# Altium schematic sheet CMSIS-DAP-Pro.SchDoc
size A4
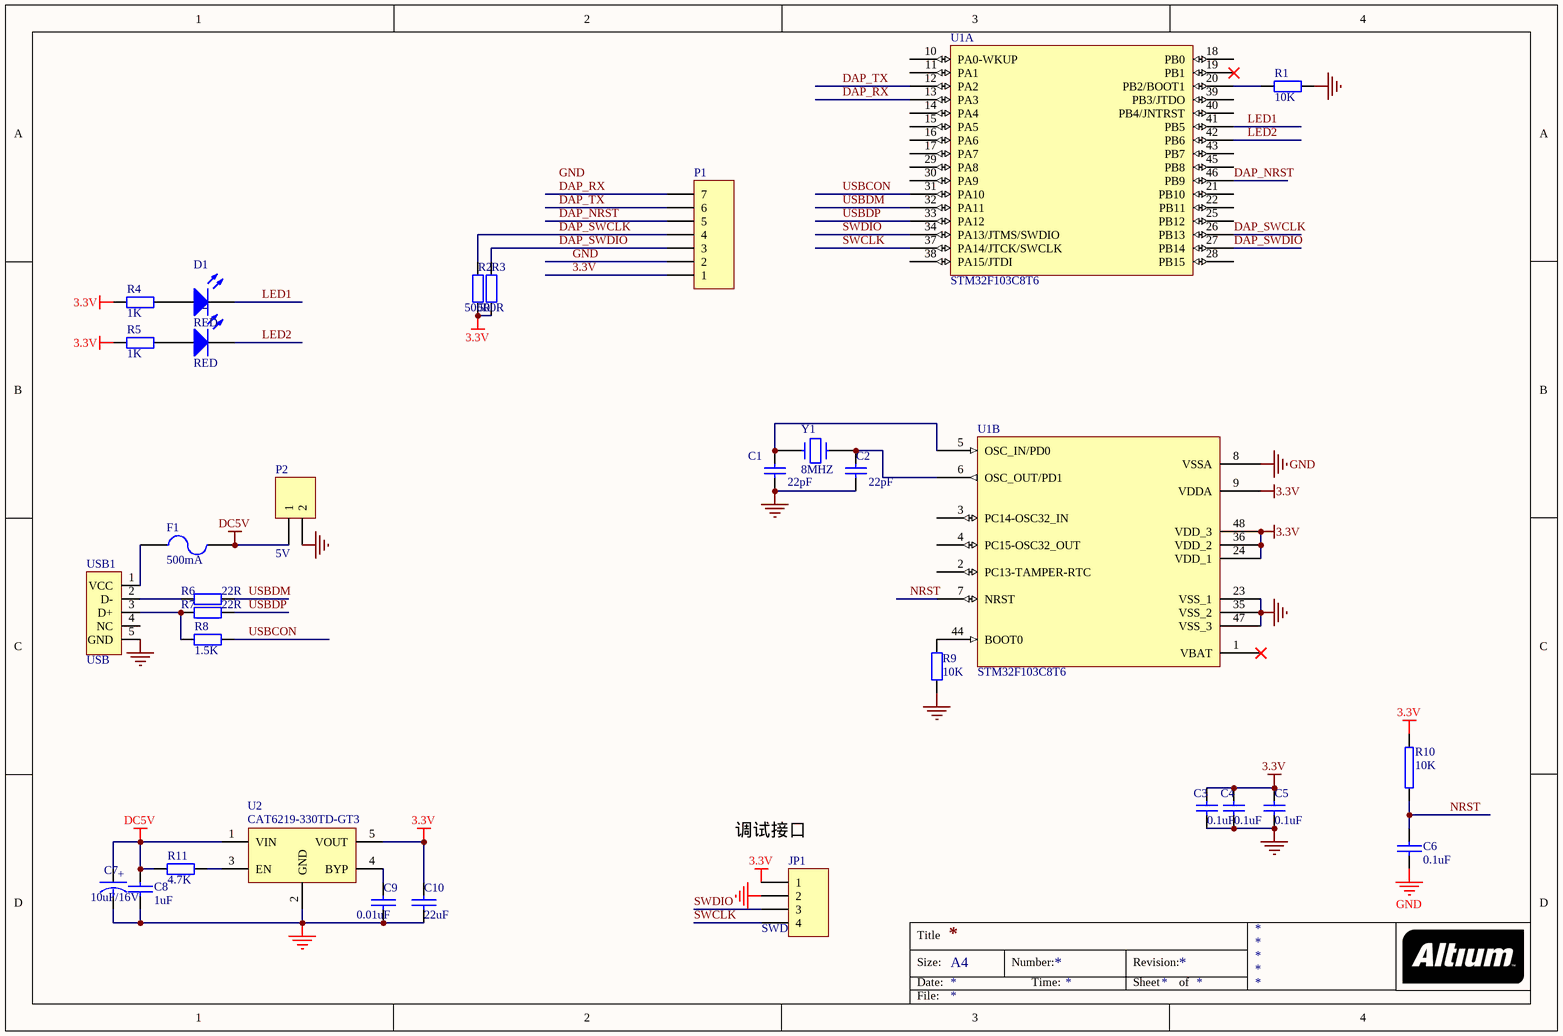
[diagram p0: CMSIS-DAP-Pro.SchDoc]

## Parts
C1  22pF  [0603C]
C2  22pF  [0603C]
C3  0.1uF  [0603C]
C4  0.1uF  [0603C]
C5  0.1uF  [0603C]
C6  0.1uF  [0603C]
C7  10uF/16V  [CAP-A]
C8  1uF  [0603C]
C9  0.01uF  [0603C]
C10  22uF  [0603C]
D1  RED  [LED-0805]
D2  RED  [LED-0805]
F1  500mA  [0805]
JP1  SWD  [PH2-4P]
P1  Header 7  [PH-7P-1.25mm]  (value not drawn)
P2  5V  [HDR1X2]
R1  10K  [0603R]
R2  500R  [0603R]
R3  500R  [0603R]
R4  1K  [0603R]
R5  1K  [0603R]
R6  22R  [0603R]
R7  22R  [0603R]
R8  value 1.5K  [0603R]  (hidden comment: Res1)
R9  10K  [0603R]
R10  10K  [0603R]
R11  4.7K  [0603R]
U1  STM32F103C8T6  [LQFP48_L]  (parts A,B of 2)
U2  CAT6219-330TD-GT3  [SOT-23-5]
USB1  USB  [USB_MINIB_SMT]
Y1  8MHZ  [SMD-5032_2P]

## Nets
3.3V: C3.2 C4.2 C5.2 C10.1 JP1.1 P1.1 R2.2 R3.2 R4.2 R5.2 R10.2 U1.9(VDDA) U1.24(VDD_1) U1.36(VDD_2) U1.48(VDD_3) U2.5(VOUT)
DC5V: C7.1 C8.1 F1.2 P2.1 R11.1 U2.1(VIN)
GND: C1.1 C2.1 C3.1 C4.1 C5.1 C6.1 C7.2 C8.2 C9.2 C10.2 JP1.2 P1.2 P2.2 R1.2 R9.2 U1.8(VSSA) U1.23(VSS_1) U1.35(VSS_2) U1.47(VSS_3) U2.2(GND) USB1.5(GND)
DAP_NRST: P1.5 U1.46(PB9)
DAP_RX: P1.7 U1.13(PA3)
DAP_SWCLK: P1.4 R2.1 U1.26(PB13)
DAP_SWDIO: P1.3 R3.1 U1.27(PB14)
DAP_TX: P1.6 U1.12(PA2)
LED1: D1.2(K) U1.41(PB5)
LED2: D2.2(K) U1.42(PB6)
NRST: C6.2 R10.1 U1.7(NRST)
SWCLK: JP1.4 U1.37(PA14/JTCK/SWCLK)
SWDIO: JP1.3 U1.34(PA13/JTMS/SWDIO)
USBCON: R8.2 U1.31(PA10)
USBDM: R6.1 U1.32(PA11)
USBDP: R7.1 U1.33(PA12)
NetC1_2: C1.2 U1.5(OSC_IN/PD0) Y1.1
NetC2_2: C2.2 U1.6(OSC_OUT/PD1) Y1.2
NetC9_1: C9.1 U2.4(BYP)
NetD1_1: D1.1(A) R4.1
NetD2_1: D2.1(A) R5.1
NetF1_1: F1.1 USB1.1(VCC)
NetR1_1: R1.1 U1.20(PB2/BOOT1)
NetR6_2: R6.2 USB1.2(D-)
NetR7_2: R7.2 R8.1 USB1.3(D+)
NetR9_1: R9.1 U1.44(BOOT0)
NetR11_2: R11.2 U2.3(EN)

Not connected (* = marked no-connect by the designer): U1 1(VBAT)* 2(PC13-TAMPER-RTC) 3(PC14-OSC32_IN) 4(PC15-OSC32_OUT) 10(PA0-WKUP) 11(PA1) 14(PA4) 15(PA5) 16(PA6) 17(PA7) 18(PB0) 19(PB1)* 21(PB10) 22(PB11) 25(PB12) 28(PB15) 29(PA8) 30(PA9) 38(PA15/JTDI) 39(PB3/JTDO) 40(PB4/JNTRST) 43(PB7) 45(PB8); USB1 4(NC)

## Notes on the sheet
- (near JP1) 调试接口
- Labels drawn without touching a wire or pin: GND
- Title
- Size:
- Date:
- A4
- Number:
- Time:
- Revision:
- Sheet
- of
- File:
- (in symbol CAPACITOR POL) +

## Library data of the parts
C1-C5 = Cap: Capacitor; Published: 8-Jun-2000; LatestRevisionDate: 17-Jul-2002; LatestRevisionNote: Re-released for DXP Platform.; PackageReference: RAD-0.3; Publisher: Altium Limited
  C3-C5: PackageDescription: Radial Cap, Thru-Hole; 2 Leads; 0.3 in Pin Spacing
C6 C8-C10 = CAP: Capacitor
C7 = CAPACITOR POL: Capacitor
D1 D2 = LED0: Typical INFRARED GaAs LED; Published: 8-Jun-2000; LatestRevisionDate: 08-Jul-2005; LatestRevisionNote: Mech Layer 1 removed.; PackageReference: LED-0; Publisher: Altium Limited; PackageDescription: LED; 2 Leads
F1 = Fuse 2: Fuse; Published: 8-Jun-2000; LatestRevisionDate: 17-Jul-2002; LatestRevisionNote: Re-released for DXP Platform.; PackageReference: PIN-W2/E2.8; Publisher: Altium Limited; PackageDescription: Thru-Hole; 2 Leads
JP1 = Header 4: Header, 4-Pin; LatestRevisionDate: 17-Jul-2002; LatestRevisionNote: Re-released for DXP Platform.; Publisher: Altium Limited
P1 = Header 7: Header, 7-Pin; LatestRevisionDate: 17-Jul-2002; LatestRevisionNote: Re-released for DXP Platform.; Publisher: Altium Limited
P2 = Header 2: Header, 2-Pin; LatestRevisionDate: 17-Jul-2002; LatestRevisionNote: Re-released for DXP Platform.; Publisher: Altium Limited
R1-R7 R9 = Res2: Resistor; Published: 8-Jun-2000; LatestRevisionDate: 17-Jul-2002; LatestRevisionNote: Re-released for DXP Platform.; Publisher: Altium Limited
  R1-R3 R6 R7 R9: PackageDescription: Axial Device, Thru-Hole; 2 Leads; 0.4 in Pin Spacing
  R4 R5: PackageReference: AXIAL-0.4; Value: 1K
R8 = Res1: 贴片电阻; Published: 8-Jun-2000; LatestRevisionDate: 17-Jul-2002; LatestRevisionNote: Re-released for DXP Platform.; PackageReference: AXIAL-0.4; Publisher: Altium Limited
R10 = RES2
R11 = Res2: Resistor; Value: 1K; Published: 8-Jun-2000; LatestRevisionDate: 17-Jul-2002; LatestRevisionNote: Re-released for DXP Platform.; PackageReference: AXIAL-0.4; Publisher: Altium Limited
U1 = STM32F103C8T6: STM32 ARM-based 32-bit MCU with 64 Kbytes Flash, 48-pin LQFP, Industrial Temperature
U2 = CAT6219: Connector
USB1 = USB5
Y1 = CRYSTAL